# Altium project DIO-SMA16-MEZZ.PrjPcb
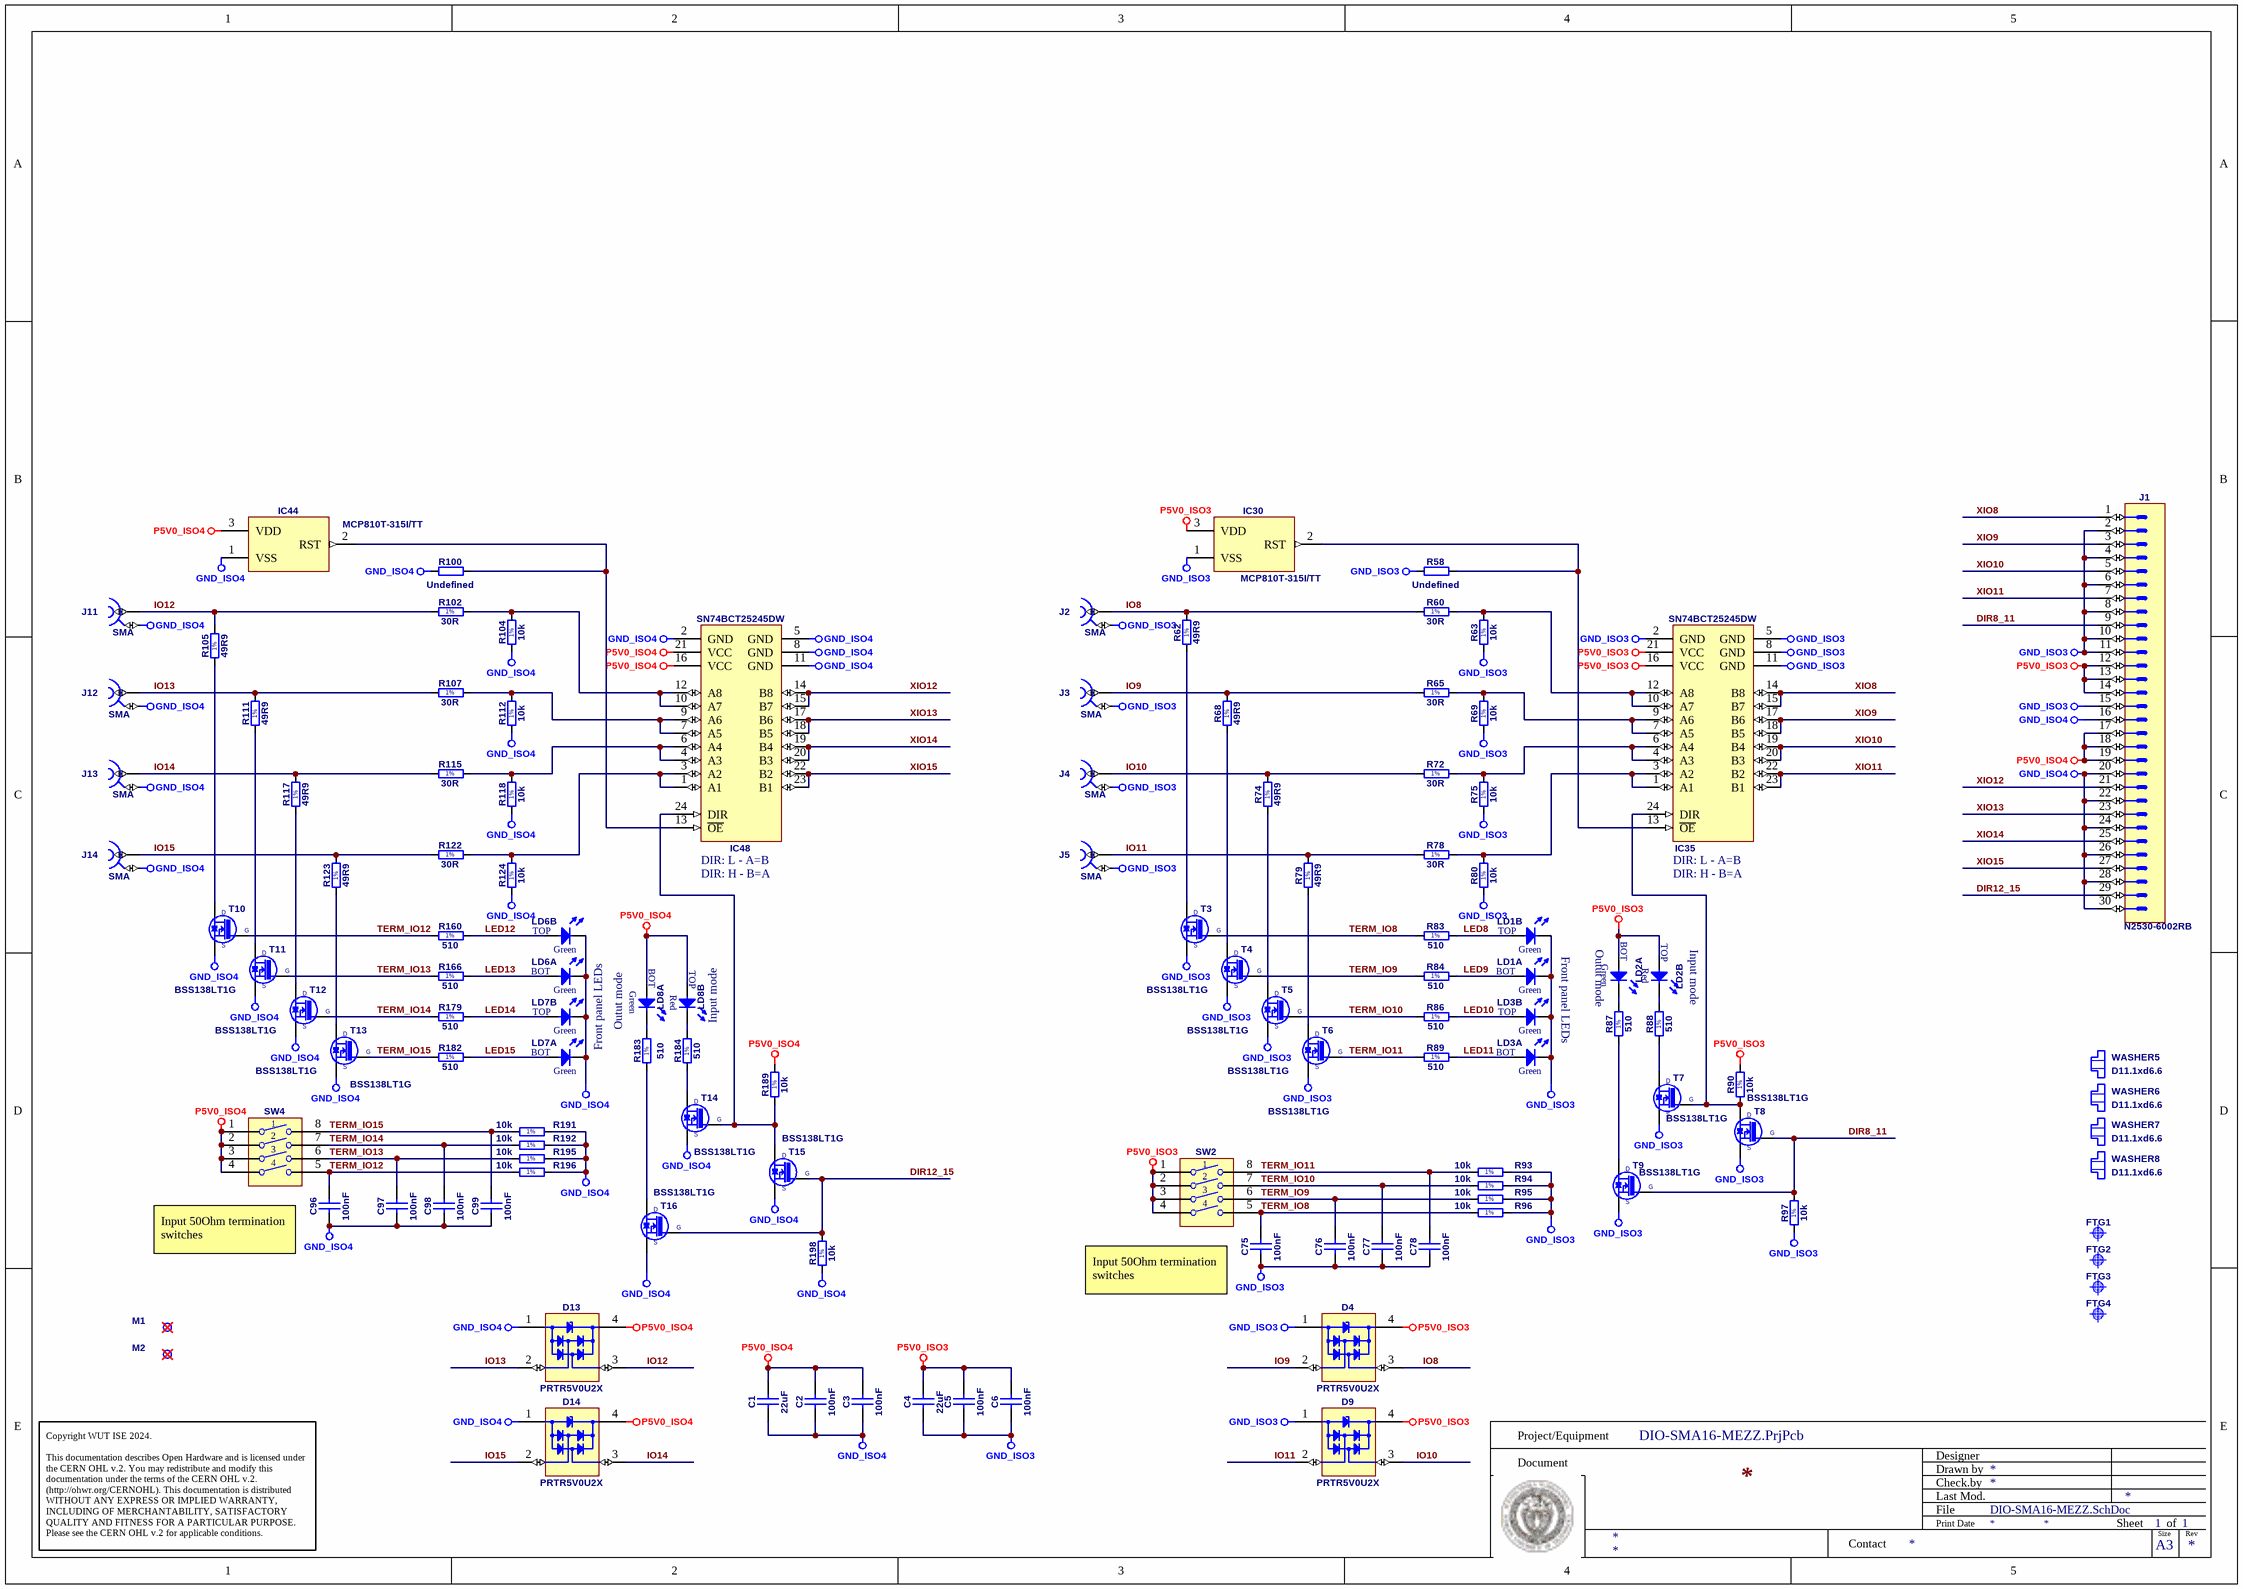
[diagram p0: DIO-SMA16-MEZZ.SchDoc]
1 sheet, 113 parts. Net scope: global (net labels, ports and power ports of the same name join across sheets).
Board file: DIO-SMA16-MEZZ.PcbDoc

## Sheet DIO-SMA16-MEZZ.SchDoc
size 420 x 297 mm; SheetNumber: 1; SheetTotal: 1

### Parts
C1  22uF  [CAPC2012X135N]
C2  100nF  [CAPC1005X55N]
C3  100nF  [CAPC1005X55N]
C4  22uF  [CAPC2012X135N]
C5  100nF  [CAPC1005X55N]
C6  100nF  [CAPC1005X55N]
C75  100nF  [CAPC1005X55N]
C76  100nF  [CAPC1005X55N]
C77  100nF  [CAPC1005X55N]
C78  100nF  [CAPC1005X55N]
C96  100nF  [CAPC1005X55N]
C97  100nF  [CAPC1005X55N]
C98  100nF  [CAPC1005X55N]
C99  100nF  [CAPC1005X55N]
D4  PRTR5V0U2X  [SOT190P230X110-4N]
D9  PRTR5V0U2X  [SOT190P230X110-4N]
D13  PRTR5V0U2X  [SOT190P230X110-4N]
D14  PRTR5V0U2X  [SOT190P230X110-4N]
FTG1  Use only in PCB  [FIDUCIAL_TOP_C100-200]  (value not drawn)
FTG2  Use only in PCB  [FIDUCIAL_TOP_S100-200]  (value not drawn)
FTG3  Use only in PCB  [FIDUCIAL_TOP_S100-200]  (value not drawn)
FTG4  Use only in PCB  [FIDUCIAL_TOP_S100-200]  (value not drawn)
IC30  MCP810T-315I/TT  [SOT95P237X112-3N]
IC35  SN74BCT25245DW  [SOIC127P1030X265-24N]
IC44  MCP810T-315I/TT  [SOT95P237X112-3N]
IC48  SN74BCT25245DW  [SOIC127P1030X265-24N]
J1  Manufacturer Part Number: N2530-6002RB  [3M_N2530-6002RB]
J2  SMA  [DELOCK_65848]
J3  SMA  [MOLEX_73251-2121]
J4  SMA  [DELOCK_65848]
J5  SMA  [MOLEX_73251-2121]
J11  SMA  [DELOCK_65848]
J12  SMA  [MOLEX_73251-2121]
J13  SMA  [DELOCK_65848]
J14  SMA  [MOLEX_73251-2121]
LD1  Green/Green  [LED_DIALIGHT_571-0122F]  (value not drawn)  (parts A,B of 2)
LD2  Red/Green  [LED_DIALIGHT_571-0112F]  (value not drawn)  (parts A,B of 2)
LD3  Green/Green  [LED_DIALIGHT_571-0122F]  (value not drawn)  (parts A,B of 2)
LD6  Green/Green  [LED_DIALIGHT_571-0122F]  (value not drawn)  (parts A,B of 2)
LD7  Green/Green  [LED_DIALIGHT_571-0122F]  (value not drawn)  (parts A,B of 2)
LD8  Red/Green  [LED_DIALIGHT_571-0112F]  (value not drawn)  (parts A,B of 2)
M1  Plated Hole  [MTG300_600]  (value not drawn)  (no BOM)
M2  Plated Hole  [MTG300_600]  (value not drawn)  (no BOM)
R58  Undefined  [RESC1005X40N]
R60  30R  [RESC3225X70N]
R62  49R9  [RESC3225X70N]
R63  10k  [RESC1005X40N]
R65  30R  [RESC3225X70N]
R68  49R9  [RESC3225X70N]
R69  10k  [RESC1005X40N]
R72  30R  [RESC3225X70N]
R74  49R9  [RESC3225X70N]
R75  10k  [RESC1005X40N]
R78  30R  [RESC3225X70N]
R79  49R9  [RESC3225X70N]
R80  10k  [RESC1005X40N]
R83  510  [RESC1005X40N]
R84  510  [RESC1005X40N]
R86  510  [RESC1005X40N]
R87  510  [RESC1005X40N]
R88  510  [RESC1005X40N]
R89  510  [RESC1005X40N]
R90  10k  [RESC1005X40N]
R93  10k  [RESC1005X40N]
R94  10k  [RESC1005X40N]
R95  10k  [RESC1005X40N]
R96  10k  [RESC1005X40N]
R97  10k  [RESC1005X40N]
R100  Undefined  [RESC1005X40N]
R102  30R  [RESC3225X70N]
R104  10k  [RESC1005X40N]
R105  49R9  [RESC3225X70N]
R107  30R  [RESC3225X70N]
R111  49R9  [RESC3225X70N]
R112  10k  [RESC1005X40N]
R115  30R  [RESC3225X70N]
R117  49R9  [RESC3225X70N]
R118  10k  [RESC1005X40N]
R122  30R  [RESC3225X70N]
R123  49R9  [RESC3225X70N]
R124  10k  [RESC1005X40N]
R160  510  [RESC1005X40N]
R166  510  [RESC1005X40N]
R179  510  [RESC1005X40N]
R182  510  [RESC1005X40N]
R183  510  [RESC1005X40N]
R184  510  [RESC1005X40N]
R189  10k  [RESC1005X40N]
R191  10k  [RESC1005X40N]
R192  10k  [RESC1005X40N]
R195  10k  [RESC1005X40N]
R196  10k  [RESC1005X40N]
R198  10k  [RESC1005X40N]
SW2  Switch  [SW_OMRON_A6S-4102-H]  (value not drawn)
SW4  Switch  [SW_OMRON_A6S-4102-H]  (value not drawn)
T3  BSS138LT1G  [SOT95P240X110-3N]
T4  BSS138LT1G  [SOT95P240X110-3N]
T5  BSS138LT1G  [SOT95P240X110-3N]
T6  BSS138LT1G  [SOT95P240X110-3N]
T7  BSS138LT1G  [SOT95P240X110-3N]
T8  BSS138LT1G  [SOT95P240X110-3N]
T9  BSS138LT1G  [SOT95P240X110-3N]
T10  BSS138LT1G  [SOT95P240X110-3N]
T11  BSS138LT1G  [SOT95P240X110-3N]
T12  BSS138LT1G  [SOT95P240X110-3N]
T13  BSS138LT1G  [SOT95P240X110-3N]
T14  BSS138LT1G  [SOT95P240X110-3N]
T15  BSS138LT1G  [SOT95P240X110-3N]
T16  BSS138LT1G  [SOT95P240X110-3N]
WASHER5  D11.1xd6.6  [Keystone_7687]
WASHER6  D11.1xd6.6  [Keystone_7687]
WASHER7  D11.1xd6.6  [Keystone_7687]
WASHER8  D11.1xd6.6  [Keystone_7687]

### Nets
GND_ISO3: C4.1 C5.1 C6.1 C75.1 C76.1 C77.1 C78.1 D4.1(GND) D9.1(GND) IC30.1(VSS) IC35.2(GND) IC35.5(GND) IC35.8(GND) IC35.11(GND) J1.2 J1.4 J1.6 J1.8 J1.10 J1.11 J1.15 J2.2 J3.2 J4.2 J5.2 LD1.1(C) LD1.3(C) LD3.1(C) LD3.3(C) R58.1 R63.1 R69.1 R75.1 R80.1 R93.2 R94.2 R95.2 R96.2 R97.1 T3.2(S) T4.2(S) T5.2(S) T6.2(S) T7.2(S) T8.2(S) T9.2(S)
GND_ISO4: C1.1 C2.1 C3.1 C96.1 C97.1 C98.1 C99.1 D13.1(GND) D14.1(GND) IC44.1(VSS) IC48.2(GND) IC48.5(GND) IC48.8(GND) IC48.11(GND) J1.16 J1.20 J1.22 J1.24 J1.26 J1.28 J1.30 J11.2 J12.2 J13.2 J14.2 LD6.1(C) LD6.3(C) LD7.1(C) LD7.3(C) R100.1 R104.1 R112.1 R118.1 R124.1 R191.2 R192.2 R195.2 R196.2 R198.1 T10.2(S) T11.2(S) T12.2(S) T13.2(S) T14.2(S) T15.2(S) T16.2(S)
P5V0_ISO3: C4.2 C5.2 C6.2 D4.4(VCC) D9.4(VCC) IC30.3(VDD) IC35.16(VCC) IC35.21(VCC) J1.12 J1.13 J1.14 LD2.2(A) LD2.4(A) R90.2 SW2.1 SW2.2 SW2.3 SW2.4
P5V0_ISO4: C1.2 C2.2 C3.2 D13.4(VCC) D14.4(VCC) IC44.3(VDD) IC48.16(VCC) IC48.21(VCC) J1.17 J1.18 J1.19 LD8.2(A) LD8.4(A) R189.2 SW4.1 SW4.2 SW4.3 SW4.4
DIR8_11: J1.9 R97.2 T8.1(G) T9.1(G)
DIR12_15: J1.29 R198.2 T15.1(G) T16.1(G)
IO8: D4.3(I/O2) J2.1 R60.1 R62.2
IO9: D4.2(I/O1) J3.1 R65.1 R68.2
IO10: D9.3(I/O2) J4.1 R72.1 R74.2
IO11: D9.2(I/O1) J5.1 R78.1 R79.2
IO12: D13.3(I/O2) J11.1 R102.1 R105.2
IO13: D13.2(I/O1) J12.1 R107.1 R111.2
IO14: D14.3(I/O2) J13.1 R115.1 R117.2
IO15: D14.2(I/O1) J14.1 R122.1 R123.2
LED8: LD1.4(A) R83.2
LED9: LD1.2(A) R84.2
LED10: LD3.4(A) R86.2
LED11: LD3.2(A) R89.2
LED12: LD6.4(A) R160.2
LED13: LD6.2(A) R166.2
LED14: LD7.4(A) R179.2
LED15: LD7.2(A) R182.2
TERM_IO8: C75.2 R83.1 R96.1 SW2.5 T3.1(G)
TERM_IO9: C76.2 R84.1 R95.1 SW2.6 T4.1(G)
TERM_IO10: C77.2 R86.1 R94.1 SW2.7 T5.1(G)
TERM_IO11: C78.2 R89.1 R93.1 SW2.8 T6.1(G)
TERM_IO12: C96.2 R160.1 R196.1 SW4.5 T10.1(G)
TERM_IO13: C97.2 R166.1 R195.1 SW4.6 T11.1(G)
TERM_IO14: C98.2 R179.1 R192.1 SW4.7 T12.1(G)
TERM_IO15: C99.2 R182.1 R191.1 SW4.8 T13.1(G)
XIO8: IC35.14(B8) IC35.15(B7) J1.1
XIO9: IC35.17(B6) IC35.18(B5) J1.3
XIO10: IC35.19(B4) IC35.20(B3) J1.5
XIO11: IC35.22(B2) IC35.23(B1) J1.7
XIO12: IC48.14(B8) IC48.15(B7) J1.21
XIO13: IC48.17(B6) IC48.18(B5) J1.23
XIO14: IC48.19(B4) IC48.20(B3) J1.25
XIO15: IC48.22(B2) IC48.23(B1) J1.27
NetIC30_2: IC30.2(RST) IC35.13(~{OE}) R58.2
NetIC35_1: IC35.1(A1) IC35.3(A2) R78.2 R80.2
NetIC35_4: IC35.4(A3) IC35.6(A4) R72.2 R75.2
NetIC35_7: IC35.7(A5) IC35.9(A6) R65.2 R69.2
NetIC35_10: IC35.10(A7) IC35.12(A8) R60.2 R63.2
NetIC35_24: IC35.24(DIR) R90.1 T7.1(G) T8.3(D)
NetIC44_2: IC44.2(RST) IC48.13(~{OE}) R100.2
NetIC48_1: IC48.1(A1) IC48.3(A2) R122.2 R124.2
NetIC48_4: IC48.4(A3) IC48.6(A4) R115.2 R118.2
NetIC48_7: IC48.7(A5) IC48.9(A6) R107.2 R112.2
NetIC48_10: IC48.10(A7) IC48.12(A8) R102.2 R104.2
NetIC48_24: IC48.24(DIR) R189.1 T14.1(G) T15.3(D)
NetLD2_1: LD2.1(C) R87.2
NetLD2_3: LD2.3(C) R88.2
NetLD8_1: LD8.1(C) R183.2
NetLD8_3: LD8.3(C) R184.2
NetR62_1: R62.1 T3.3(D)
NetR68_1: R68.1 T4.3(D)
NetR74_1: R74.1 T5.3(D)
NetR79_1: R79.1 T6.3(D)
NetR87_1: R87.1 T9.3(D)
NetR88_1: R88.1 T7.3(D)
NetR105_1: R105.1 T10.3(D)
NetR111_1: R111.1 T11.3(D)
NetR117_1: R117.1 T12.3(D)
NetR123_1: R123.1 T13.3(D)
NetR183_1: R183.1 T16.3(D)
NetR184_1: R184.1 T14.3(D)

Not connected (* = marked no-connect by the designer): M1 1*; M2 1*

### Notes on the sheet
- (near IC48) DIR: L - A=B
- (near IC35) DIR: L - A=B
- (near IC48) DIR: H - B=A
- (near IC35) DIR: H - B=A
- Front panel LEDs
- Outut mode
- Input mode
- Input 50Ohm termination switches
- Project/Equipment
- Document
- Designer
- Drawn by
- Check.by
- Copyright WUT ISE 2024.
  This documentation describes Open Hardware and is licensed under the CERN OHL v.2. You may redistribute and modify this documentation under the terms of the CERN OHL v.2. (http://ohwr.org/CERNOHL). This documentation is distributed WITHOUT ANY EXPRESS OR IMPLIED WARRANTY, INCLUDING OF MERCHANTABILITY, SATISFACTORY QUALITY AND FITNESS FOR A PARTICULAR PURPOSE. Please see the CERN OHL v.2 for applicable conditions.
- Contact
- File
- Last Mod.
- Print Date
- Sheet
- Size
- A3
- of
- Rev
- (in symbol LED_DIALIGHT_571-0112F, part A) BOT; Green
- (in symbol LED_DIALIGHT_571-0112F, part B) TOP; Red
- (in symbol LED_DIALIGHT_571-0122F, part A) BOT; Green
- (in symbol LED_DIALIGHT_571-0122F, part B) TOP; Green
- (in symbol R0402_10K_1%_0.0625W_100PPM) 1%
- (in symbol R0402_510R_1%_0.0625W_100PPM) 1%
- (in symbol R1210_30R_5%_0.5W_200PPM) 1%
- (in symbol R1210_49R9_1%_0.5W_100PPM_VISHAY_CRCW) 1%

### Library data of the parts
C1 C4 = CC0805_22UF_16V_10%_X5R: Non-polarised capacitor; Part Description: SMD Multilayer Chip Ceramic Capacitor; Manufacturer: GENERIC; Manufacturer1 Part Number: C2012X5R1C226KT; Voltage: 16V; TC: X5R; Tolerance: ±10%; Part Number: CC0805_22UF_16V_10%_X5R; Component Kind: Standard; Component Type: Standard; Pin Count: 2; Value: 22uF; Status: Preferred; Manufacturer Part Number: CC0805_22UF_16V_10%_X5R; Case: 0805; Mounted: Yes; Socket: No; SMD: Yes; Sense: No; Manufacturer1 Example: TDK; Manufacturer1 ComponentHeight: 1.35mm; HelpURL: \\cern.ch\dfs\Applications\Altium\Datasheets\CC0805_X5R_TDK_C.pdf; Author: CERN DEM JLC; CreateDate: 25.10.2012; LatestRevisionDate: 25.10.2012
C2 C3 C5 C6 C75-C78 C96-C99 = CC0402_100NF_16V_10%_X5R: Non-polarised capacitor; Part Description: SMD Multilayer Chip Ceramic Capacitor; Manufacturer: GENERIC; Manufacturer1 Part Number: GRM155R61C104KA88D; Voltage: 16V; TC: X5R; Tolerance: ±10%; Part Number: CC0402_100NF_16V_10%_X5R; Component Kind: Standard; Component Type: Standard; Pin Count: 2; Value: 100nF; Status: None; Manufacturer Part Number: CC0402_100NF_16V_10%_X5R; Case: 0402; Mounted: Yes; Socket: No; SMD: Yes; Sense: No; Manufacturer1 Example: MURATA; Manufacturer1 ComponentHeight: 0.55mm; HelpURL: \\cern.ch\dfs\Applications\Altium\Datasheets\CC0402_X5R_MURATA_GRM.pdf; Author: CERN DEM JLC; CreateDate: 10.12.2013; LatestRevisionDate: 10.12.2013
D4 D9 D13 D14 = PRTR5V0U2X: Ultra Low Capacitance Double Rail-to-Rail ESD Protection Diode; Part Description: Ultra Low Capacitance (1pF) Double Rail-to-Rail ESD Protection Diode (8kV); Manufacturer: NXP SEMICONDUCTORS; Voltage: 5.5V; PressFit: No; Bonding: No; Part Number: PRTR5V0U2X; Component Kind: Standard; Component Type: Standard; Device: PRTR5V0U2X; PackageDescription: SOT143B, SOT, 1.90mm Pitch; 4 Pin, 1.30mm W X 2.90mm L X 1.10mm H body, IPC Medium Density; Manufacturer Part Number: PRTR5V0U2X; Pin Count: 4; Case: SOT143B; Mounted: Yes; Socket: No; SMD: Yes; Sense: No; ComponentHeight: 1.1mm; HelpURL: \\cern.ch\dfs\Applications\Altium\Datasheets\PRTR5V0U2X.pdf; Author: CERN DEM JLC; CreateDate: 22.03.2011; LatestRevisionDate: 22.03.2011
FTG1 = FIDUCIAL_TARGET_C100-200: Fiducial Target; Part Description: Round Fiducial Target, Top Layer, 1.0mm, Top Solder 2.0mm, Keepout =2.0mm; Mounted: No; Part Number: FIDUCIAL_TARGET_C100-200; Component Kind: Standard (No BOM); Component Type: Standard (No BOM); Pin Count: 1; Family: Fiducial; Socket: No; SMD: Yes; Sense: No; Status: None; ComponentHeight: 0mm; HelpURL: Undefined; Author: CERN DEM JLC; CreateDate: 09.02.2010; LatestRevisionDate: 04.04.2012; PackageDescription: Round Fiducial Target, Top Layer, 1.0mm, Top Solder 2.0mm, Keepout =2.0mm
FTG2-FTG4 = FIDUCIAL_TARGET_S100-200: Fiducial Target; Part Description: Square Fiducial Target, Top Layer, 1.0mm, Top Solder 2.0mm, Keepout =2.0mm; Mounted: No; Part Number: FIDUCIAL_TARGET_S100-200; Component Kind: Standard (No BOM); Component Type: Standard (No BOM); Pin Count: 1; Family: Fiducial; Socket: No; SMD: Yes; Sense: No; Status: None; ComponentHeight: 0mm; HelpURL: Undefined; Author: CERN DEM JLC; CreateDate: 09.02.2010; LatestRevisionDate: 04.04.2012; PackageDescription: Square Fiducial Target, Top Layer, 1.0mm, Top Solder 2.0mm, Keepout =2.0mm
IC30 IC44 = VMON_MCP810: 3.075V Microcontroller Supervisory Circuit With Push-Pull Output; Manufacturer: MICROCHIP TECHNOLOGY; PressFit: No; Bonding: No; Part Number: MCP810T-315I/TT; Component Kind: Standard; Component Type: Standard; Device: MCP810T-315I/TT; PackageDescription: SOT, 0.95mm, pitch; 3 pin,1.30mm W X 2.92mm L X 1.12mm H body, IPC Medium Density; Part Description: 3.075V Microcontroller Supervisory Circuit With Push-Pull Output; Manufacturer Part Number: MCP810T-315I/TT; Pin Count: 3; Case: SOT23; Mounted: Yes; Socket: No; SMD: Yes; Sense: No; ComponentHeight: 1.12mm; Author: GK; HelpURL: \\cern.ch\dfs\Applications\Altium\Datasheets\MCP809T-315I-TT.pdf; CreateDate: 16.06.2011; LatestRevisionDate: 16.06.2011
IC35 IC48 = SN74BCT25245DW: 25 Ohms Octal Bus Transceiver With 3-State Outputs; Manufacturer: TEXAS INSTRUMENTS; PressFit: No; Bonding: No; Part Number: SN74BCT25245DW; Component Kind: Standard; Component Type: Standard; Device: SN74BCT25245DW; PackageDescription: SOIC 24, Pitch 1.27mm - Body 7.6x15.6mm, IPC Medium Density; Part Description: 25 Ohms Octal Bus Transceiver With 3-State Outputs; Manufacturer Part Number: SN74BCT25245DW; Pin Count: 24; Case: SOIC24; Mounted: Yes; Socket: No; SMD: Yes; Sense: No; ComponentHeight: 2.65mm; Author: CERN DEM JLC; HelpURL: \\cern.ch\dfs\Applications\Altium\Datasheets\SN74BCT25245DW.pdf; CreateDate: 09.11.2009; LatestRevisionDate: 09.11.2009
J1 = 3M_N2530-6002RB: Connector 30 Male; Part Description: 30 Contacts - Straight .100'' x .100'' Low Profile Four-Wall Header, 2500 Series; Manufacturer: 3M; PressFit: No; Part Number: 3M_N2530-6002RB; Component Kind: Standard; Component Type: Standard; Pin Count: 30; Family: Header 30; Mounted: Yes; Socket: No; SMD: No; Sense: No; Status: None; ComponentHeight: 10.03mm; HelpURL: \\cern.ch\dfs\Applications\Altium\Datasheets\3M_N2530-6002RB.pdf; Author: CERN DEM JLC; CreateDate: 11.02.2009; LatestRevisionDate: 11.08.2009
J2 J4 J11 J13 = DELOCK_65848: 50 Ohm Through Hole SMA Right Angle PCB Jack; Manufacturer: DELOCK; Manufacturer Part Number: 5848 (4043619658480); PressFit: No; Part Number: DELOCK_65848; Component Kind: Standard; Component Type: Standard; Pin Count: 5; Family: SMA; Mounted: Yes; Socket: No; SMD: No; Sense: No; Status: None; Part Description: 50 Ohm Through Hole SMA Right Angle PCB Jack; ComponentHeight: 12.5; HelpURL: \\cern.ch\dfs\Applications\Altium\Datasheets\AMPHENOL_132203-16.pdf; Author: GK; CreateDate: 13.05.2019; LatestRevisionDate: 13.05.2019
J3 J5 J12 J14 = MOLEX_73251-2121: Part Description: 50 Ohms SMA Edge Mount PCB, With Jam Nut And Lock Washer; Manufacturer: MOLEX; PressFit: No; Part Number: MOLEX_73251-2121; Component Kind: Standard; Component Type: Standard; Pin Count: 5; Family: SMA; Mounted: Yes; Socket: No; SMD: No; Sense: No; Status: None; Manufacturer Part Number: 73251-2121; ComponentHeight: 5.75mm; HelpURL: \\cern.ch\dfs\Applications\Altium\Datasheets\MOLEX_73251-2121.pdf; Author: CERN DEM JLC; CreateDate: 26.10.2016; LatestRevisionDate: 27.03.2017
LD1 LD3 LD6 LD7 = LED_DIALIGHT_571-0122F: LED x2 Green 1C2A-BOT_3C4A-TOP; Part Description: Dual 2mm Green LEDs CBI® Circuit Board Indicator (Without positioning pins); PressFit: No; Bonding: No; Part Number: LED_DIALIGHT_571-0122F; Component Kind: Standard; Component Type: Standard; Color: Green/Green; PackageDescription: 2x 2mm Red LED PCB Edge Mounting (Without positioning pins) DIALIGHT 571 Serie; Manufacturer: DIALIGHT; Manufacturer Part Number: 571-0122F; Pin Count: 4; Mounted: Yes; Socket: No; SMD: No; Sense: No; ComponentHeight: 8.6mm; HelpURL: \\cern.ch\dfs\Applications\Altium\Datasheets\LED_DIALIGHT_571-0122F.pdf; Author: CERN DEM JLC; CreateDate: 09.11.2009; LatestRevisionDate: 17.03.2010
LD2 LD8 = LED_DIALIGHT_571-0112F: 2x LED  Botom Green, Top Red; Part Description: Dual 2mm  LEDs, Red Top,Green Bot, CBI® Circuit Board Indicator (Without positioning pins); PressFit: No; Bonding: No; Part Number: LED_DIALIGHT_571-0112F; Component Kind: Standard; Component Type: Standard; Color: Red/Green; PackageDescription: 2x 2mm LED (Top: Red, Bot: Green) PCB Edge Mounting (Without positioning pins) DIALIGHT 571 Serie; Manufacturer: DIALIGHT; Manufacturer Part Number: 571-0112F; Pin Count: 4; Mounted: Yes; Socket: No; SMD: No; Sense: No; ComponentHeight: 8.6mm; HelpURL: \\cern.ch\dfs\Applications\Altium\Datasheets\LED_DIALIGHT_571-0112F.pdf; Author: CERN DEM JLC; CreateDate: 09.11.2009; LatestRevisionDate: 17.03.2010
M1 M2 = PLATED_HOLE3.0_PAD6.0: Single Terminal Socket; Part Description: Plated Through Hole: Hole Dia.=3.0mm Pad Dia.=6.0mm; Mounted: No; Table: Pads; Part Number: PLATED_HOLE3.0_PAD6.0; Component Type: Standard (No BOM); Designator: Single Terminal Socket; Library Reference: Single Terminal Socket; Pin Count: 1; Family: Plated Hole; Socket: No; SMD: No; Status: None; ComponentHeight: 0mm; Author: CERN DEM JLC; CreateDate: 26.05.2008; LatestRevisionDate: 26.05.2008; PackageDescription: Plated Through Hole: Hole Dia.=3.0mm Pad Dia.=6.0mm
R58 R100 = R0402_NO-VALUE: Resistor; Part Description: Reserved Footprint For a 0402 (1005) Chip Resistor; PressFit: No; Mounted: No; Part Number: R0402_NO-VALUE; Component Kind: Standard; Component Type: Standard; Pin Count: 2; Value: Undefined; Status: None; Manufacturer: Undefined; Manufacturer Part Number: R0402_NO-VALUE; Case: 0402; Sense: No; Socket: No; SMD: Yes; Manufacturer1 Example: Undefined; Manufacturer1 Part Number: Undefined; Manufacturer1 ComponentHeight: Undefined; HelpURL: Undefined; Author: CERN DEM JLC; CreateDate: 03.12.2007; LatestRevisionDate: 13.03.2008
R60 R65 R72 R78 R102 R107 R115 R122 = R1210_30R_5%_0.5W_200PPM: Resistor - 5%; Part Description: Thick Film Chip Resistor; Manufacturer: VISHAY; Manufacturer Part Number: CRCW121030R0JNEA; Power: 0.5W; TC: ±200ppm/°C; PressFit: No; Part Number: R1210_30R_5%_0.5W_200ppm; Component Kind: Standard; Component Type: Standard; Pin Count: 2; Value: 30R; Status: None; Tolerance: ±5%; Case: 1210; Mounted: Yes; Sense: No; Socket: No; SMD: Yes; HelpURL: \\cern.ch\dfs\Applications\Altium\Datasheets\R1210_VISHAY_CRCW1210.pdf; Author: CERN DEM JMW; CreateDate: 06.08.2014; LatestRevisionDate: 06.08.2014; ComponentHeight: 0.6mm
R62 R68 R74 R79 R105 R111 R117 R123 = R1210_49R9_1%_0.5W_100PPM_VISHAY_CRCW: Resistor - 1%; Part Description: Thick Film Chip Resistor; Manufacturer: VISHAY DRALORIC; Manufacturer Part Number: CRCW121049R9FKTA; Power: 0.5W; TC: ±100ppm/°C; Part Number: R1210_49R9_1%_0.5W_100PPM_VISHAY_CRCW; Component Kind: Standard; Component Type: Standard; Pin Count: 2; Value: 49R9; Status: None; Tolerance: ±1%; Case: 1210; Mounted: Yes; Sense: No; Socket: No; SMD: Yes; ComponentHeight: 0.6mm; HelpURL: \\cern.ch\dfs\Applications\Altium\Datasheets\R1210_VISHAY_CRCW1210.pdf; Author: CERN DEM JMW; CreateDate: 06.08.2014; LatestRevisionDate: 06.08.2014
R63 R69 R75 R80 R90 R93-R97 R104 R112 R118 R124 R189 R191 R192 R195 R196 R198 = R0402_10K_1%_0.0625W_100PPM: Resistor - 1%; Part Description: General Purpose Thick Film Chip Resistor; Manufacturer: GENERIC; Manufacturer1 Part Number: 232270671003L; TC: ±100ppm/°C; Part Number: R0402_10K_1%_0.0625W_100PPM; Component Kind: Standard; Component Type: Standard; Pin Count: 2; Value: 10k; Status: Not recommended; Power: 0.0625W; Tolerance: ±1%; Manufacturer Part Number: R0402_10K_1%_0.0625W_100PPM; Case: 0402; Mounted: Yes; Sense: No; Socket: No; SMD: Yes; Manufacturer1 Example: YAGEO PHYCOMP; Manufacturer1 ComponentHeight: 0.4mm; HelpURL: \\cern.ch\dfs\Applications\Altium\Datasheets\R0402_Phycomp_RC0402.pdf; Author: CERN DEM JLC; CreateDate: 03.12.2007; LatestRevisionDate: 17.10.2012
R83 R84 R86-R89 R160 R166 R179 R182-R184 = R0402_510R_1%_0.0625W_100PPM: Resistor - 1%; Part Description: General Purpose Thick Film Chip Resistor; Manufacturer: GENERIC; Manufacturer1 Part Number: 232270675101L; TC: ±100ppm/°C; Part Number: R0402_510R_1%_0.0625W_100PPM; Component Kind: Standard; Component Type: Standard; Pin Count: 2; Value: 510; Status: Not recommended; Power: 0.0625W; Tolerance: ±1%; Manufacturer Part Number: R0402_510R_1%_0.0625W_100PPM; Case: 0402; Mounted: Yes; Sense: No; Socket: No; SMD: Yes; Manufacturer1 Example: YAGEO PHYCOMP; Manufacturer1 ComponentHeight: 0.4mm; HelpURL: \\cern.ch\dfs\Applications\Altium\Datasheets\R0402_Phycomp_RC0402.pdf; Author: CERN DEM JLC; CreateDate: 03.12.2007; LatestRevisionDate: 17.10.2012
SW2 SW4 = SW_OMRON_A6S-4102-H: 4 Ways SPST DIP Switch; Part Description: 4 Ways SPST DIP Switch, White Flat Actuator with Seal Tape, Contact Rating 25mA 24VDC; Manufacturer: OMRON; PressFit: No; Part Number: SW_OMRON_A6S-4102-H; Component Kind: Standard; Component Type: Standard; Pin Count: 8; PackageDescription: Pitch 2.54mm, Body 11.3x6.4mm, 4 Ways SPST Surface-Mounting DIP Switch, OMRON A6S-H; Family: Switch; Mounted: Yes; Socket: No; SMD: Yes; Sense: No; Status: None; Manufacturer Part Number: A6S-4102-H; ComponentHeight: 3.8mm; HelpURL: \\cern.ch\dfs\Applications\Altium\Datasheets\SW_OMRON_A6S-4102-H.pdf; Author: CERN DEM JMW; CreateDate: 25.09.2008; LatestRevisionDate: 25.09.2008
T3-T16 = BSS138LT1G: N-CHANNEL MOSFET WITH DIODE; Part Description: 50V 200mA N-Channel Enhancement Mode Field-Effect Transistor; Manufacturer: ON SEMICONDUCTOR; PressFit: No; Bonding: No; Part Number: BSS138LT1G; Component Kind: Standard; Component Type: Standard; Device: BSS138LT1G; PackageDescription: SOT23 3-Leads, Pitch 0.95mm - Body 1.4x3mm, IPC Medium Density; Manufacturer Part Number: BSS138LT1G; Pin Count: 3; Case: SOT23-3; Mounted: Yes; Socket: No; SMD: Yes; Sense: No; ComponentHeight: 1.11mm; HelpURL: \\cern.ch\dfs\Applications\Altium\Datasheets\BSS138LT1G.pdf; Author: CERN DEM JLC; CreateDate: 23.03.2009; LatestRevisionDate: 23.03.2009
WASHER5-WASHER8 = Keystone_7687: SMA_Shoulder Washer; Part Number: Custom 3D; Part Description: Polyphenylene Sulfide PPS Shoulder Washer; PressFit: No; Component Kind: Standard; Component Type: Mechanical; Footprint: Custom 3D; Pin Count: 0; PackageDescription: Polyphenylene Sulfide PPS Shoulder Washer; Mounted: Yes; Socket: No; SMD: No; Sense: No; Status: None; Value: D11.1xd6.6; Manufacturer: Custom 3D; Manufacturer Part Number: Custom 3D; ComponentHeight: 1.91mm; HelpURL: \\cern.ch\dfs\Applications\Altium\Datasheets\AAVID-THERMALLOY_7721-7PPSG.pdf; Author: GK; CreateDate: 28.01.2016; LatestRevisionDate: 28.01.2016